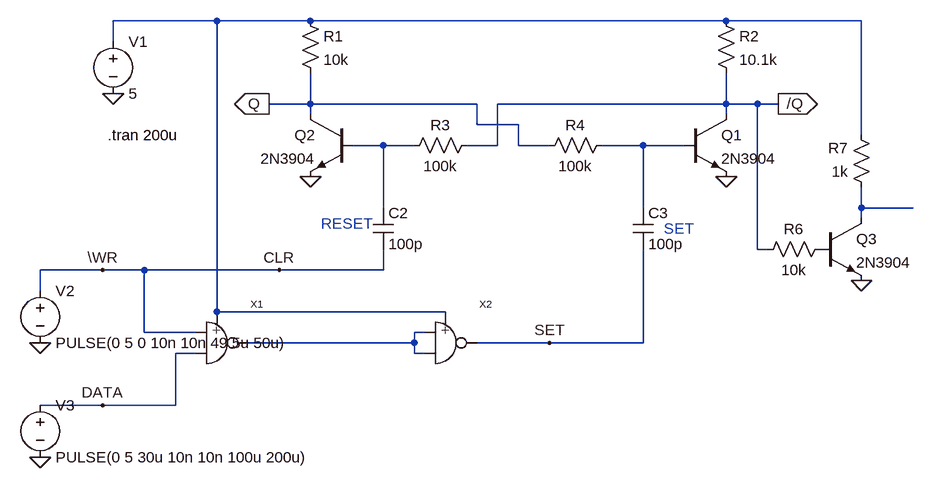
[diagram p0: schematic SR.asc]
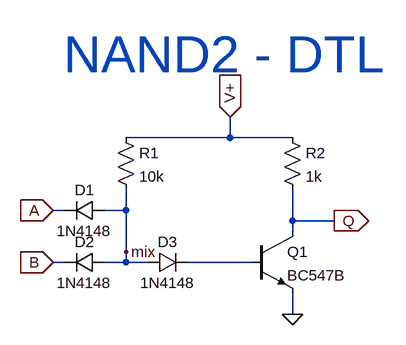
[diagram p1: sub-circuit nand2.asc]
SR.asc, the LTspice schematic file:
Version 4
SHEET 1 1220 864
WIRE 144 176 -16 176
WIRE 288 176 144 176
WIRE 928 176 288 176
WIRE 1136 176 928 176
WIRE -16 208 -16 176
WIRE 288 304 288 256
WIRE 288 304 224 304
WIRE 544 304 288 304
WIRE 928 304 928 256
WIRE 928 304 576 304
WIRE 976 304 928 304
WIRE 1008 304 976 304
WIRE 288 320 288 304
WIRE 928 320 928 304
WIRE 544 336 544 304
WIRE 608 336 544 336
WIRE 1136 352 1136 176
WIRE 400 368 352 368
WIRE 448 368 400 368
WIRE 576 368 576 304
WIRE 576 368 528 368
WIRE 608 368 608 336
WIRE 656 368 608 368
WIRE 800 368 736 368
WIRE 864 368 800 368
WIRE 400 464 400 368
WIRE 800 464 800 368
WIRE 1136 464 1136 432
WIRE 1216 464 1136 464
WIRE 1136 480 1136 464
WIRE 976 528 976 304
WIRE 992 528 976 528
WIRE -32 560 -128 560
WIRE 32 560 -32 560
WIRE 240 560 32 560
WIRE 400 560 400 528
WIRE 400 560 240 560
WIRE -128 592 -128 560
WIRE 144 624 144 176
WIRE 496 624 144 624
WIRE 32 656 32 560
WIRE 112 656 32 656
WIRE 464 656 448 656
WIRE 448 672 448 656
WIRE 448 672 192 672
WIRE 656 672 544 672
WIRE 800 672 800 528
WIRE 800 672 656 672
WIRE 112 688 80 688
WIRE 448 688 448 672
WIRE 464 688 448 688
WIRE -32 768 -128 768
WIRE 80 768 80 688
WIRE 80 768 -32 768
FLAG 288 416 0
FLAG 928 416 0
FLAG -16 288 0
FLAG 1008 304 /Q
IOPIN 1008 304 Out
FLAG -128 672 0
FLAG -128 848 0
FLAG -32 560 \WR
FLAG -32 768 DATA
FLAG 240 560 CLR
FLAG 656 672 SET
FLAG 224 304 Q
IOPIN 224 304 Out
FLAG 1136 576 0
SYMBOL npn 864 320 R0
SYMATTR InstName Q1
SYMATTR Value 2N3904
SYMBOL npn 352 320 M0
SYMATTR InstName Q2
SYMATTR Value 2N3904
SYMBOL res 272 160 R0
SYMATTR InstName R1
SYMATTR Value 10k
SYMBOL res 912 160 R0
SYMATTR InstName R2
SYMATTR Value 10.1k
SYMBOL voltage -16 192 R0
SYMATTR InstName V1
SYMATTR Value 5
SYMBOL res 544 352 R90
WINDOW 0 0 56 VBottom 2
WINDOW 3 32 56 VTop 2
SYMATTR InstName R3
SYMATTR Value 100k
SYMBOL res 752 352 R90
WINDOW 0 0 56 VBottom 2
WINDOW 3 32 56 VTop 2
SYMATTR InstName R4
SYMATTR Value 100k
SYMBOL NAND2 144 672 R0
SYMATTR InstName X1
SYMBOL NAND2 496 672 R0
SYMATTR InstName X2
SYMBOL voltage -128 576 R0
SYMATTR InstName V2
SYMATTR Value PULSE(0 5 0 10n 10n 49.5u 50u)
SYMBOL voltage -128 752 R0
SYMATTR InstName V3
SYMATTR Value PULSE(0 5 30u 10n 10n 100u 200u)
SYMBOL cap 384 464 R0
SYMATTR InstName C2
SYMATTR Value 100p
SYMBOL cap 784 464 R0
SYMATTR InstName C3
SYMATTR Value 100p
SYMBOL npn 1072 480 R0
SYMATTR InstName Q3
SYMATTR Value 2N3904
SYMBOL res 1088 512 R90
WINDOW 0 0 56 VBottom 2
WINDOW 3 32 56 VTop 2
SYMATTR InstName R6
SYMATTR Value 10k
SYMBOL res 1152 448 R180
WINDOW 0 36 76 Left 2
WINDOW 3 36 40 Left 2
SYMATTR InstName R7
SYMATTR Value 1k
TEXT -24 352 Left 2 !.tran 200u
TEXT 832 496 Left 2 ;SET
TEXT 304 488 Left 2 ;RESET

nand2.asc, the sub-circuit schematic file:
Version 4
SHEET 1 880 680
WIRE 288 -48 288 -80
WIRE 288 -48 128 -48
WIRE 384 -48 288 -48
WIRE 32 64 16 64
WIRE 128 64 128 32
WIRE 128 64 96 64
WIRE 384 80 384 32
WIRE 448 80 384 80
WIRE 384 96 384 80
WIRE 128 128 128 64
WIRE 32 144 16 144
WIRE 128 144 128 128
WIRE 128 144 96 144
WIRE 160 144 128 144
WIRE 320 144 224 144
WIRE 384 224 384 192
FLAG 384 224 0
FLAG 448 80 Q
IOPIN 448 80 Out
FLAG 16 64 A
IOPIN 16 64 In
FLAG 16 144 B
IOPIN 16 144 In
FLAG 288 -80 V+
IOPIN 288 -80 In
FLAG 128 128 mix
SYMBOL diode 96 48 R90
WINDOW 0 0 32 VBottom 2
WINDOW 3 32 32 VTop 2
SYMATTR InstName D1
SYMATTR Value 1N4148
SYMBOL res 112 -64 R0
SYMATTR InstName R1
SYMATTR Value 10k
SYMBOL npn 320 96 R0
SYMATTR InstName Q1
SYMATTR Value BC547B
SYMBOL res 368 -64 R0
SYMATTR InstName R2
SYMATTR Value 1k
SYMBOL diode 96 128 R90
WINDOW 0 0 32 VBottom 2
WINDOW 3 32 32 VTop 2
SYMATTR InstName D2
SYMATTR Value 1N4148
SYMBOL diode 160 160 R270
WINDOW 0 32 32 VTop 2
WINDOW 3 0 32 VBottom 2
SYMATTR InstName D3
SYMATTR Value 1N4148
TEXT 32 -176 Left 6 ;NAND2 - DTL

The netlist it stands for:
* SR.asc
Q1 /Q N003 0 0 2N3904
Q2 Q N002 0 0 2N3904
R1 N001 Q 10k
R2 N001 /Q 10.1k
V1 N001 0 5
R3 /Q N002 100k
R4 N003 Q 100k
XX1 CLR DATA N005 N001 nand2
XX2 N005 N005 SET N001 nand2
V2 CLR 0 PULSE(0 5 0 10n 10n 49.5u 50u)
V3 DATA 0 PULSE(0 5 30u 10n 10n 100u 200u)
C2 N002 CLR 100p
C3 N003 SET 100p
Q3 N004 P001 0 0 2N3904
R6 P001 /Q 10k
R7 N004 N001 1k

* block symbol definitions
.subckt nand2 A B Q V+
D1 mix A 1N4148
R1 V+ mix 10k
Q1 Q N001 0 0 BC547B
R2 V+ Q 1k
D2 mix B 1N4148
D3 mix N001 1N4148
* NAND2 - DTL
.ends nand2

.model D D
.lib standard.dio
.model NPN NPN
.model PNP PNP
.lib standard.bjt
.tran 200u
* SET
* RESET
.backanno
.end